# EAGLE design sensor_hubv3 (EAGLE 6.2)
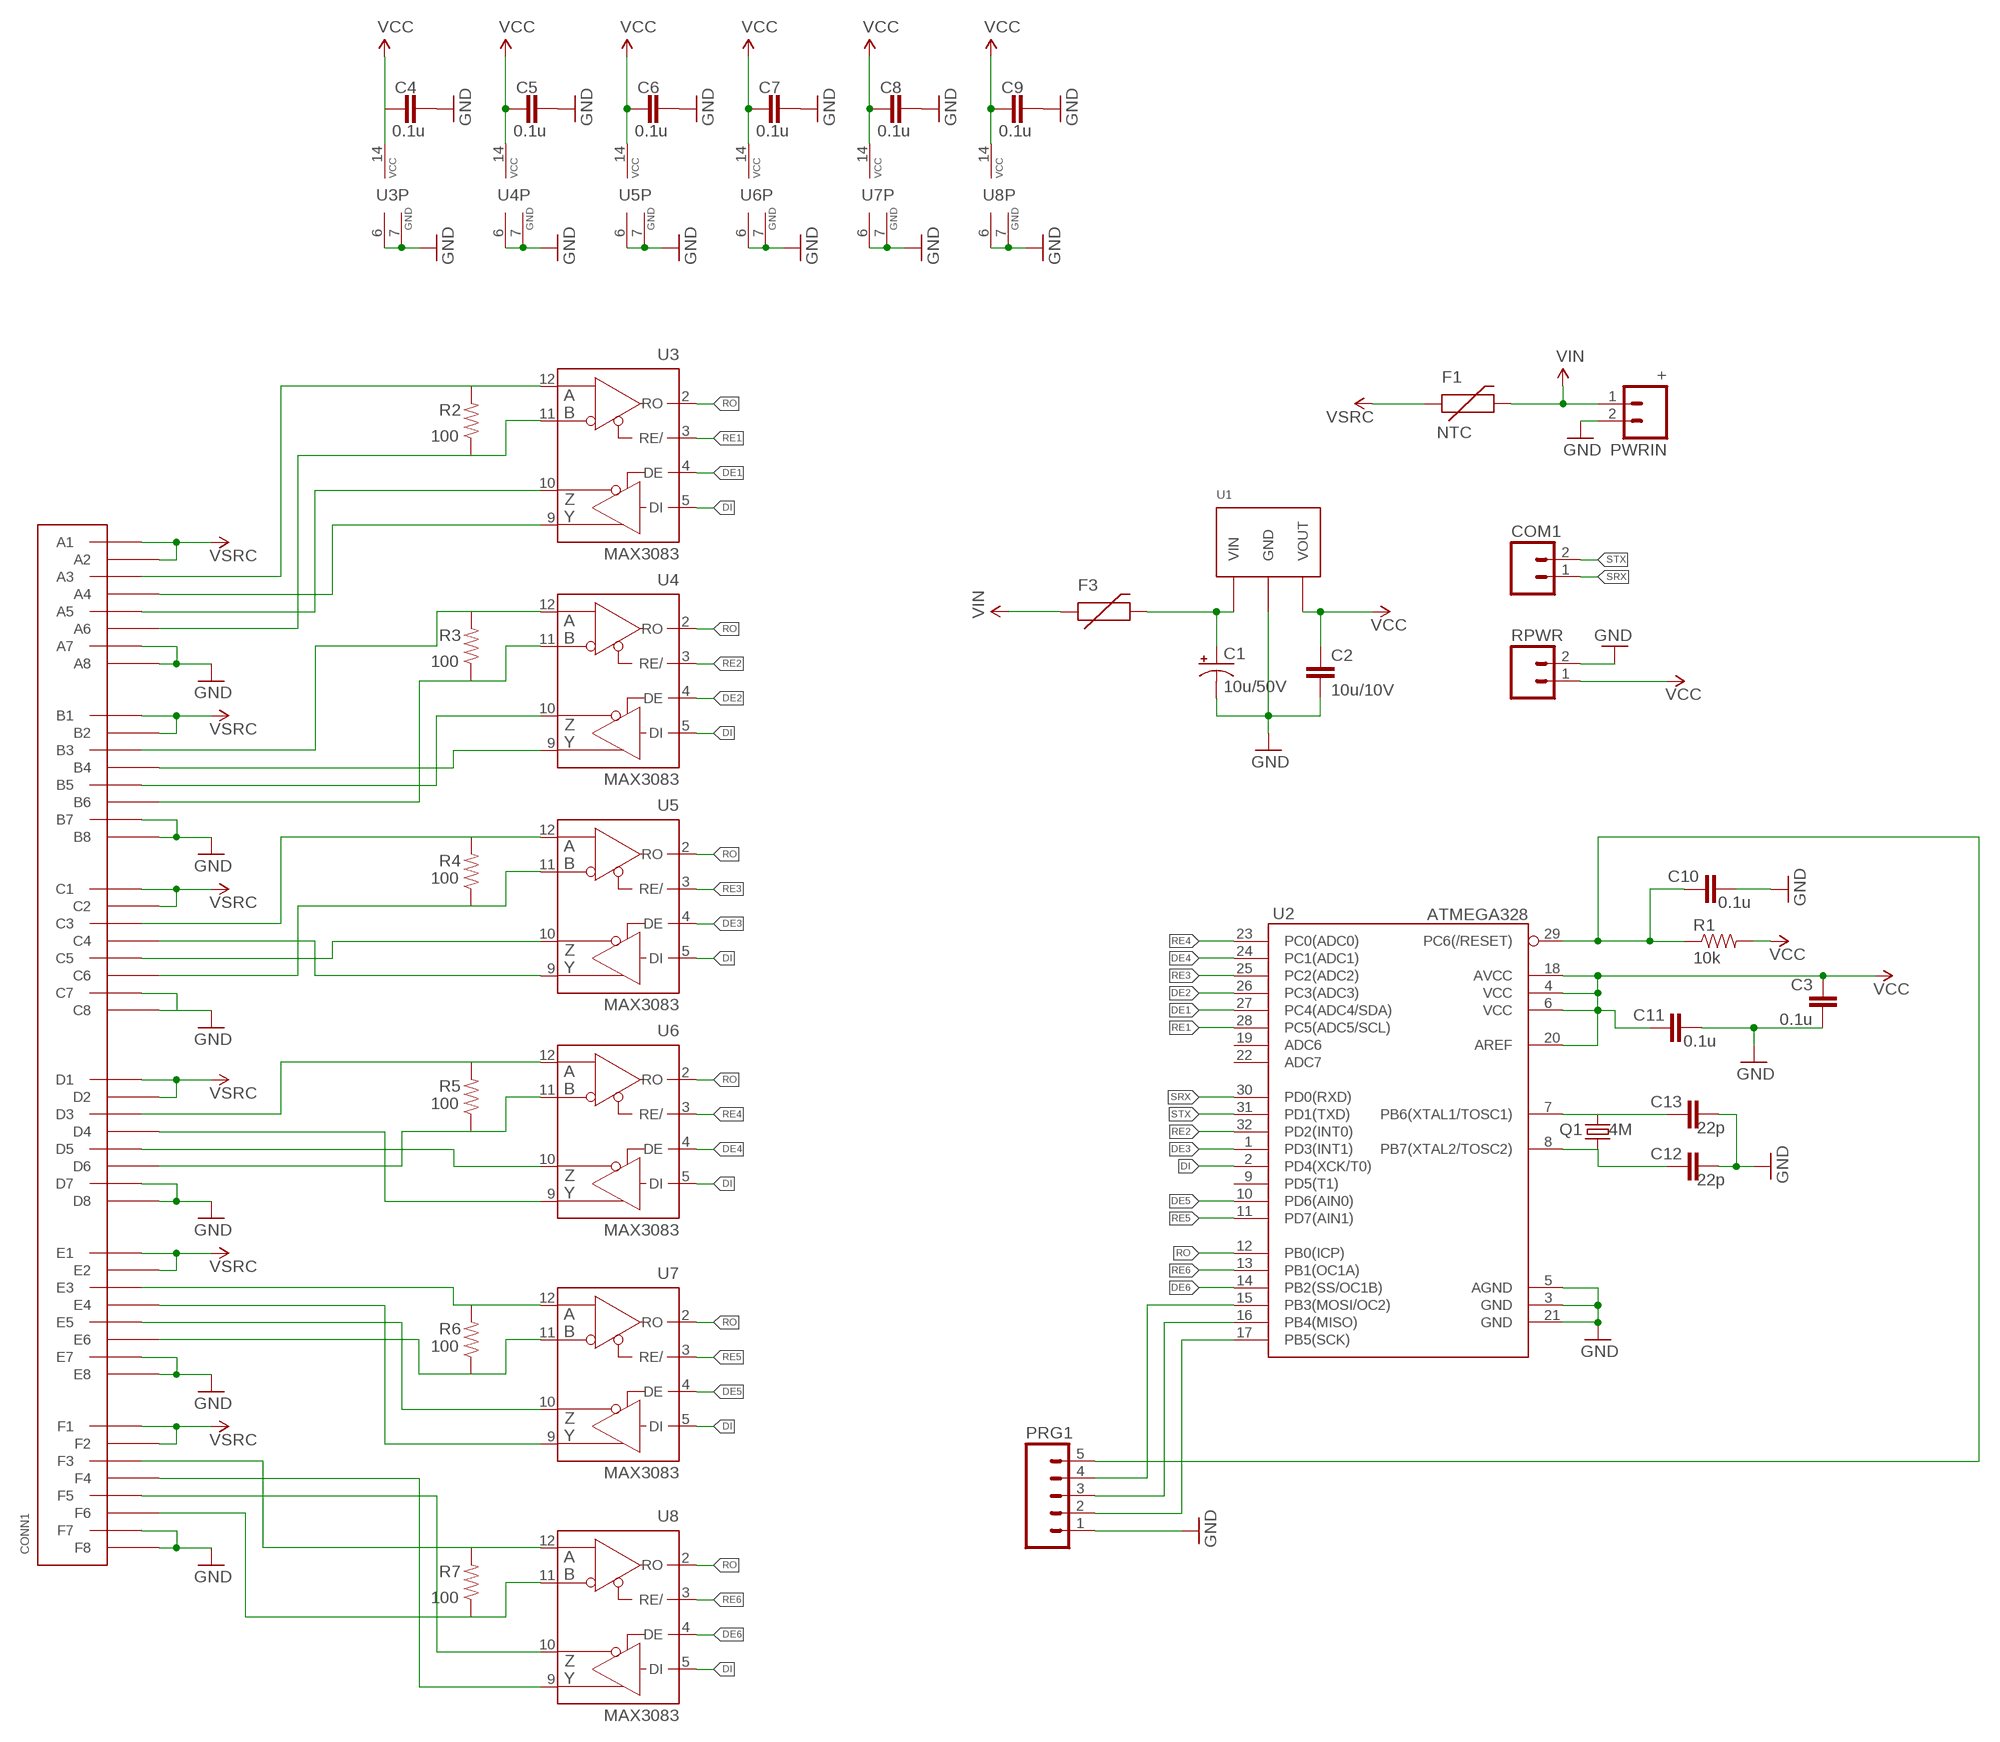
[diagram p0: schematic, sheet 1]

## Parts
C1  10u/50V  CAP_POLC  [PANASONIC_C]
C2  10u/10V  CAP0805  [0805]
C3  0.1u  CAP0805  [0805]
C4  0.1u  CAP0805  [0805]
C5  0.1u  CAP0805  [0805]
C6  0.1u  CAP0805  [0805]
C7  0.1u  CAP0805  [0805]
C8  0.1u  CAP0805  [0805]
C9  0.1u  CAP0805  [0805]
C10  0.1u  CAP0805  [0805]
C11  0.1u  CAP0805  [0805]
C12  22p  CAP0805  [0805]
C13  22p  CAP0805  [0805]
COM1  M02LOCK_LONGPADS  [1X02_LOCK_LONGPADS]
CONN1  8P8C-6PORT  [4UCON-04953]
F1  NTC  PTCPTH2  [R-7,5]
F3  PTC0603  [0603]
PRG1  M05LOCK  [1X05_LOCK]
PWRIN  +  M025MM  [SCREWTERMINAL-5MM-2]
Q1  4M  CRYSTALHC49UP  [HC49UP]
R1  10k  RESISTOR0805-RES  [0805]
R2  100  RESISTOR0805-RES  [0805]
R3  100  RESISTOR0805-RES  [0805]
R4  100  RESISTOR0805-RES  [0805]
R5  100  RESISTOR0805-RES  [0805]
R6  100  RESISTOR0805-RES  [0805]
R7  100  RESISTOR0805-RES  [0805]
RPWR  M02LOCK_LONGPADS  [1X02_LOCK_LONGPADS]
U1  OKI-78SR  [OKI-78SR]
U2  ATMEGA328  ATMEGA168  [TQFP32-08]
U3  MAX3083  MAX489CSD  [SO14]
U4  MAX3083  MAX489CSD  [SO14]
U5  MAX3083  MAX489CSD  [SO14]
U6  MAX3083  MAX489CSD  [SO14]
U7  MAX3083  MAX489CSD  [SO14]
U8  MAX3083  MAX489CSD  [SO14]

## Nets
DE1: U2.27(PC4(ADC4/SDA)) U3.4(DE)
DE2: U2.26(PC3(ADC3)) U4.4(DE)
DE3: U2.1(PD3(INT1)) U5.4(DE)
DE4: U2.24(PC1(ADC1)) U6.4(DE)
DE5: U2.10(PD6(AIN0)) U7.4(DE)
DE6: U2.14(PB2(SS/OC1B)) U8.4(DE)
DI: U2.2(PD4(XCK/T0)) U3.5(DI) U4.5(DI) U5.5(DI) U6.5(DI) U7.5(DI) U8.5(DI)
GND: C1.- C2.2 C3.1 C4.2 C5.2 C6.2 C7.2 C8.2 C9.2 C10.2 C11.2 C12.2 C13.2 CONN1.A7 CONN1.A8 CONN1.B7 CONN1.B8 CONN1.C7 CONN1.C8 CONN1.D7 CONN1.D8 CONN1.E7 CONN1.E8 CONN1.F7 CONN1.F8 PRG1.1 PWRIN.2 RPWR.2 U1.GND U2.3(GND) U2.5(AGND) U2.21(GND) U3.6(GND) U3.7(GND) U4.6(GND) U4.7(GND) U5.6(GND) U5.7(GND) U6.6(GND) U6.7(GND) U7.6(GND) U7.7(GND) U8.6(GND) U8.7(GND)
N$1: CONN1.C4 U5.9(Y)
N$2: C13.1 Q1.2 U2.7(PB6(XTAL1/TOSC1))
N$3: C1.+ F3.2 U1.VIN
N$4: C12.1 Q1.1 U2.8(PB7(XTAL2/TOSC2))
N$5: C10.1 PRG1.5 R1.1 U2.29(PC6(/RESET))
N$6: PRG1.4 U2.15(PB3(MOSI/OC2))
N$7: PRG1.3 U2.16(PB4(MISO))
N$8: PRG1.2 U2.17(PB5(SCK))
N$9: CONN1.A3 R2.2 U3.12(A)
N$10: CONN1.D6 R5.1 U6.11(B)
N$11: CONN1.C3 R4.2 U5.12(A)
N$12: CONN1.D3 R5.2 U6.12(A)
N$13: CONN1.E3 R6.2 U7.12(A)
N$14: CONN1.F3 R7.2 U8.12(A)
N$15: CONN1.A6 R2.1 U3.11(B)
N$16: CONN1.B6 R3.1 U4.11(B)
N$17: CONN1.C6 R4.1 U5.11(B)
N$18: CONN1.A5 U3.10(Z)
N$19: CONN1.E6 R6.1 U7.11(B)
N$20: CONN1.F6 R7.1 U8.11(B)
N$22: CONN1.B3 R3.2 U4.12(A)
N$23: CONN1.B5 U4.10(Z)
N$24: CONN1.C5 U5.10(Z)
N$25: CONN1.D5 U6.10(Z)
N$26: CONN1.E5 U7.10(Z)
N$27: CONN1.F5 U8.10(Z)
N$28: CONN1.A4 U3.9(Y)
N$29: CONN1.B4 U4.9(Y)
N$30: CONN1.D4 U6.9(Y)
N$31: CONN1.E4 U7.9(Y)
N$32: CONN1.F4 U8.9(Y)
RE1: U2.28(PC5(ADC5/SCL)) U3.3(RE/)
RE2: U2.32(PD2(INT0)) U4.3(RE/)
RE3: U2.25(PC2(ADC2)) U5.3(RE/)
RE4: U2.23(PC0(ADC0)) U6.3(RE/)
RE5: U2.11(PD7(AIN1)) U7.3(RE/)
RE6: U2.13(PB1(OC1A)) U8.3(RE/)
RO: U2.12(PB0(ICP)) U3.2(RO) U4.2(RO) U5.2(RO) U6.2(RO) U7.2(RO) U8.2(RO)
SRX: COM1.1 U2.30(PD0(RXD))
STX: COM1.2 U2.31(PD1(TXD))
VCC: C2.1 C3.2 C4.1 C5.1 C6.1 C7.1 C8.1 C9.1 C11.1 R1.2 RPWR.1 U1.VOUT U2.4(VCC) U2.6(VCC) U2.18(AVCC) U2.20(AREF) U3.14(VCC) U4.14(VCC) U5.14(VCC) U6.14(VCC) U7.14(VCC) U8.14(VCC)
VIN: F1.P$2 F3.1 PWRIN.1
VSRC: CONN1.A1 CONN1.A2 CONN1.B1 CONN1.B2 CONN1.C1 CONN1.C2 CONN1.D1 CONN1.D2 CONN1.E1 CONN1.E2 CONN1.F1 CONN1.F2 F1.P$1
Unconnected: U2.9(PD5(T1)) U2.19(ADC6) U2.22(ADC7) U3.1(NC) U3.8(NC) U3.13(NC) U4.1(NC) U4.8(NC) U4.13(NC) U5.1(NC) U5.8(NC) U5.13(NC) U6.1(NC) U6.8(NC) U6.13(NC) U7.1(NC) U7.8(NC) U7.13(NC) U8.1(NC) U8.8(NC) U8.13(NC)

## Library data of the parts
C1 = SparkFun-Capacitors:CAP_POL: Capacitor Polarized These are standard SMD and PTH capacitors. Normally 10uF, 47uF, and 100uF in electrolytic and tantalum varieties. Always verify the external diameter of the through hole cap, it varies with capacity, voltage, and manufacturer. The EIA devices should be standard.
C2-C13 = SparkFun-Passives:CAP: Capacitor Standard 0603 ceramic capacitor, and 0.1" leaded capacitor.
COM1 RPWR = SparkFun:M02: Header 2 Standard 2-pin 0.1" header. Use with straight break away headers (SKU : PRT-00116), right angle break away headers (PRT-00553), swiss pins (PRT-00743), machine pins (PRT-00117), and female headers (PRT-00115). Molex polarized connector foot print use with SKU : PRT-08233 with associated crimp pins and housings.
CONN1 = exoteric-analytics-custom:8P8C-6PORT
F1 F3 = exoteric-analytics-custom:PTC: Resettable Fuse PTC Resettable Fuse. Spark Fun Electronics SKU : COM-08357
PRG1 = SparkFun:M05: Header 5 Standard 5-pin 0.1" header. Use with straight break away headers (SKU : PRT-00116), right angle break away headers (PRT-00553), swiss pins (PRT-00743), machine pins (PRT-00117), and female headers (PRT-00115). Molex polarized connector foot print use with SKU : PRT-08230 with associated crimp pins and housings.
PWRIN = SparkFun-Connectors:M02: Header 2 Standard 2-pin 0.1" header. Use with straight break away headers (SKU : PRT-00116), right angle break away headers (PRT-00553), swiss pins (PRT-00743), machine pins (PRT-00117), and female headers (PRT-00115). Molex polarized connector foot print use with SKU : PRT-08233 with associated crimp pins and housings.
Q1 = crystal:CRYSTAL: CRYSTAL; OC_FARNELL: unknown; OC_NEWARK: unknown
R1-R7 = SparkFun-Passives:RESISTOR: Resistor Basic schematic elements and footprints for 0603, 1206, and PTH resistors.
U1 = exoteric-analytics-custom:OKI-78SR: DC/DC Converter
U2 = SparkFun-DigitalIC:ATMEGA168: Atmel 32-pin 8-bit micro, 16k flash.
U3-U8 = maxim:MAX489CSD: RS485 TRANSEIVER; MF: MAXIM; MPN: MAX489CSD; OC_FARNELL: 9724559; OC_NEWARK: 34C3923

## Board
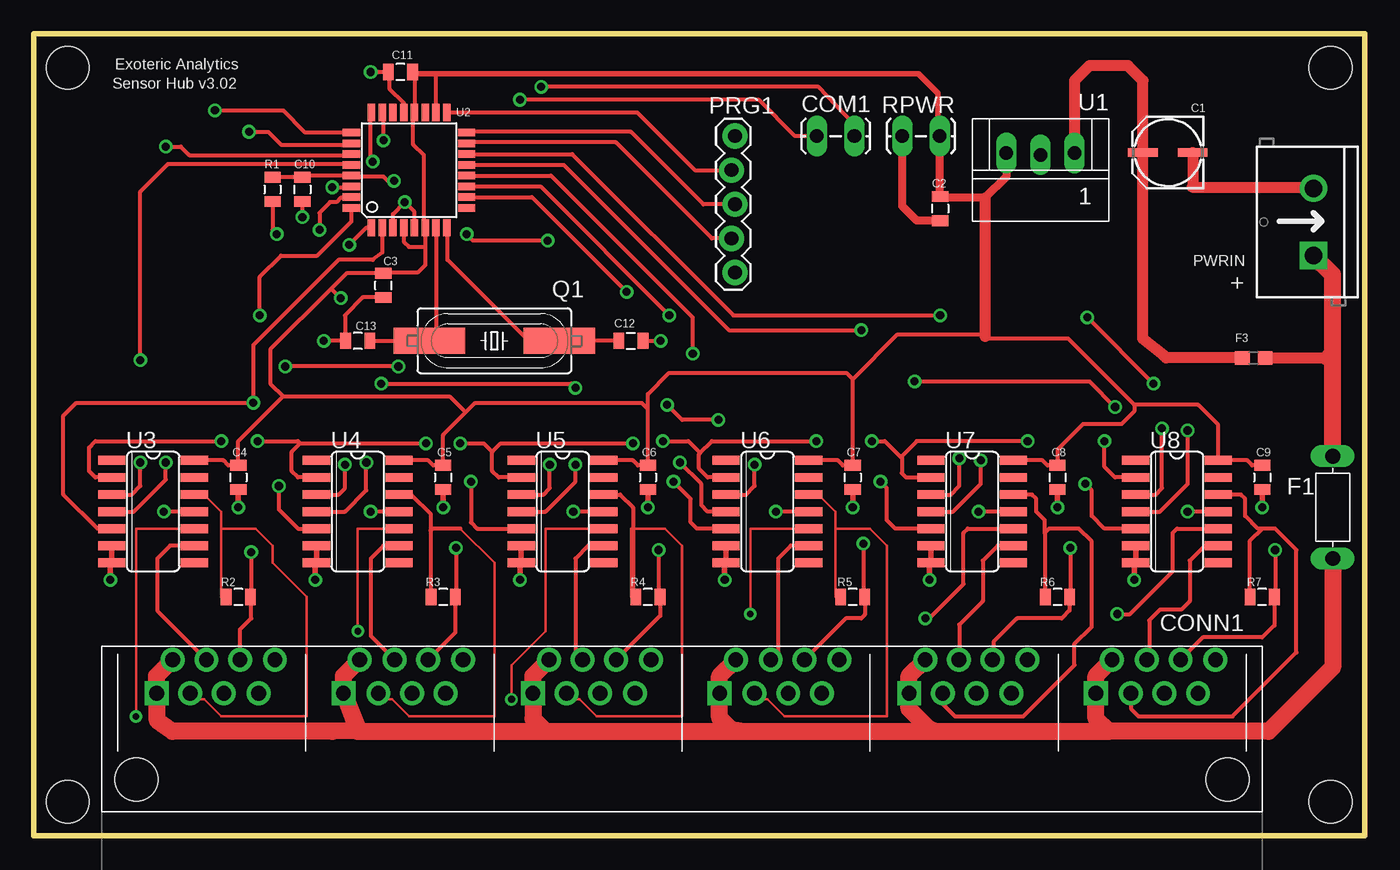
[diagram p1: board, top side]
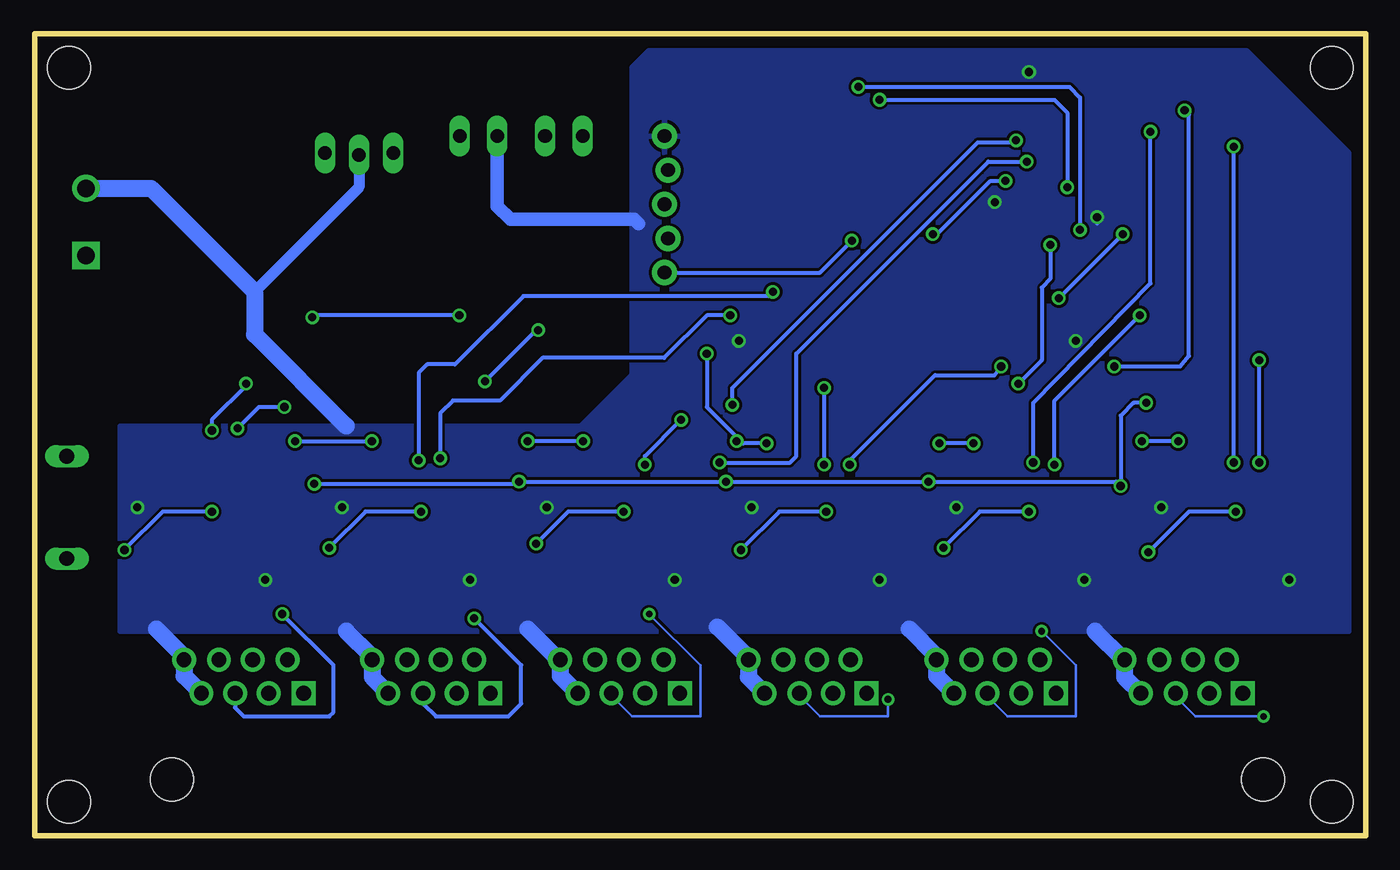
[diagram p2: board, bottom side, seen from below]

Size 99.06 x 59.69 mm. Coordinates in mm from the lower left corner, seen from the top.
Outline: 0,0 0,59.69 99.06,59.69 99.06,0 0,0
Copper layers (1*16): Top 0.035mm / dielectric 1.5mm / Bottom 0.035mm
Design rules: minimum track width 8mil, minimum drill 20mil, track to track 8mil, track to pad 8mil, pad to pad 8mil, via to via 8mil, smd to smd 8mil, copper to edge 20mil, drill to drill 8mil, minimum pad ring 10mil, minimum via ring 8mil, stop-mask expansion 4mil, vias tented up to drill 0mil, thermal gap 10mil
Holes 3.2 mm at 2.54,2.54 2.54,57.15 96.52,2.54 96.52,57.15

### Footprints (pad centres in the part's own frame; a part is rotated, then mirrored left to right if it is on the bottom)
PANASONIC_C = smd 2.2 x 0.65: + 1.9,-0.2; - -1.8,-0.2
0805 = smd 0.8 x 1.2: 1 -0.9,0; 2 0.9,0
1X02_LOCK_LONGPADS = drill 1.016 long: 1 -0.127,0; 2 2.667,0
4UCON-04953 = drill 1.1 pad 1.778 square: A1 -39.1,6.8; B1 -25.2,6.8; C1 -11.1,6.8; D1 2.8,6.8; E1 16.9,6.8; F1 30.8,6.8 | drill 1.1 pad 1.778: A2 -37.9,9.3; A3 -36.6,6.8; A4 -35.4,9.3; A5 -34.1,6.8; A6 -32.9,9.3; A7 -31.5,6.8; A8 -30.3,9.3; B2 -24,9.3; B3 -22.6,6.8; B4 -21.4,9.3; B5 -20.1,6.8; B6 -18.9,9.3; B7 -17.6,6.8; B8 -16.3,9.3; C2 -9.9,9.3; C3 -8.6,6.8; C4 -7.4,9.3; C5 -6.1,6.8; C6 -4.9,9.3; C7 -3.5,6.8; C8 -2.3,9.3; D2 4,9.3; D3 5.4,6.8; D4 6.6,9.3; D5 7.9,6.8; D6 9.1,9.3; D7 10.4,6.8; D8 11.7,9.3; E2 18.1,9.3; E3 19.4,6.8; E4 20.6,9.3; E5 21.9,6.8; E6 23.1,9.3; E7 24.5,6.8; E8 25.7,9.3; F2 32,9.3; F3 33.4,6.8; F4 34.6,9.3; F5 35.9,6.8; F6 37.1,9.3; F7 38.4,6.8; F8 39.7,9.3 | hole 3.2: -40.6,0.4; 40.6,0.4
R-7,5 = drill 1.1 long: P$1 -3.81,0; P$2 3.81,0
0603 = smd 1.1 x 1: 1 -0.85,0; 2 0.85,0
1X05_LOCK = drill 1.016 pad 1.88: 1 0,0.127; 2 2.54,-0.127; 3 5.08,0.127; 4 7.62,-0.127; 5 10.16,0.127
SCREWTERMINAL-5MM-2 = drill 1.3 pad 2.032 square: 1 0,0 | drill 1.3 pad 2.032: 2 5,0
HC49UP = smd 5.334 x 1.93: 1 -4.826,0; 2 4.826,0
OKI-78SR = drill 1 long: GND 0,-1.143; VIN -2.54,-1.27; VOUT 2.54,-1.27
TQFP32-08 = smd 1.27 x 0.559: 1 -4.293,2.8; 2 -4.293,2; 3 -4.293,1.2; 4 -4.293,0.4; 5 -4.293,-0.4; 6 -4.293,-1.2; 7 -4.293,-2; 8 -4.293,-2.8; 17 4.293,-2.8; 18 4.293,-2; 19 4.293,-1.2; 20 4.293,-0.4; 21 4.293,0.4; 22 4.293,1.2; 23 4.293,2; 24 4.293,2.8 | smd 0.559 x 1.27: 9 -2.8,-4.293; 10 -2,-4.293; 11 -1.2,-4.293; 12 -0.4,-4.293; 13 0.4,-4.293; 14 1.2,-4.293; 15 2,-4.293; 16 2.8,-4.293; 25 2.8,4.293; 26 2,4.293; 27 1.2,4.293; 28 0.4,4.293; 29 -0.4,4.293; 30 -1.2,4.293; 31 -2,4.293; 32 -2.8,4.293
SO14 = smd 0.66 x 2.032: 1 -3.81,-3.073; 2 -2.54,-3.073; 3 -1.27,-3.073; 4 0,-3.073; 5 1.27,-3.073; 6 2.54,-3.073; 7 3.81,-3.073; 8 3.81,3.073; 9 2.54,3.073; 10 1.27,3.073; 11 0,3.073; 12 -1.27,3.073; 13 -2.54,3.073; 14 -3.81,3.073

### Placement (x,y rotation side)
C1  84.45,50.64 180 top
C2  67.47,46.67 270 top
C3  26.04,40.96 90 top
C4  15.24,26.67 270 top
C5  30.48,26.67 270 top
C6  45.72,26.67 270 top
C7  60.96,26.67 270 top
C8  76.2,26.67 270 top
C9  91.44,26.67 270 top
C10  20,48.1 270 top
C11  27.3,56.83 180 top
C12  44.45,36.83 0 top
C13  24.13,36.83 180 top
COM1  58.42,52.07 0 top
CONN1  48.26,3.81 0 top
F1  96.68,24.45 90 top
F3  90.81,35.56 180 top
PRG1  52.07,52.07 270 top
PWRIN  95.25,43.18 90 top
Q1  34.29,36.83 180 top
R1  17.78,48.1 270 top
R2  15.24,17.78 180 top
R3  30.48,17.78 180 top
R4  45.72,17.78 180 top
R5  60.96,17.78 180 top
R6  76.2,17.78 180 top
R7  91.44,17.78 180 top
RPWR  67.31,52.07 180 top
U1  74.93,49.53 180 top
U2  27.94,49.53 90 top
U3  8.89,24.13 270 top
U4  24.13,24.13 270 top
U5  39.37,24.13 270 top
U6  54.61,24.13 270 top
U7  69.85,24.13 270 top
U8  85.09,24.13 270 top

### Tracks (layer width: path | path; a pad name or v marks a point on that pad's centre or on a via)
DE1  (via drill 0.6)
  Top 0.305: U3.4 7.46,24.13 9.84,26.51 v9.84,27.78 | v9.84,51.28 10.95,51.28 11.59,50.64 23.56,50.64 U2.27
  Bottom 0.305: v9.84,27.78 v9.84,51.28
DE2  (via drill 0.6)
  Top 0.305: U4.4 23.18,24.13 24.77,25.72 v24.77,27.78 | v16.03,52.39 17.46,52.39 18.41,51.44 23.55,51.44 U2.26
  Bottom 0.305: v24.77,27.78 24.77,32.23 16.03,41.12 v16.03,52.39
DE3  (via drill 0.6)
  Top 0.305: U5.4 38.1,24.13 40.32,26.35 v40.32,27.62 | U2.1 24.76,45.24 v23.5,43.97 | v25.88,33.66 40.01,33.66 v40.32,33.34
  Bottom 0.305: v23.5,43.97 23.5,41.43 24.13,40.8 24.13,35.4 v25.88,33.66 | v40.32,33.34 v40.32,27.62
DE4  (via drill 0.6)
  Top 0.305: U6.4 50.16,24.13 49.69,24.61 49.69,26.19 v48.1,27.78 | v25.24,50.16 25.24,50.32 25.08,50.48 25.08,53.77 U2.24
  Bottom 0.305: v48.1,27.78 42.86,27.78 42.39,28.26 42.39,35.88 28.1,50.16 v25.24,50.16
DE5  (via drill 0.6)
  Top 0.305: U7.4 68.42,24.13 70.48,26.19 v70.48,27.94 | U2.10 37.08,47.53 v44.13,40.48
  Bottom 0.305: v44.13,40.48 44.45,40.16 62.71,40.16 67.79,35.08 69.85,35.08 70.48,34.45 v70.48,27.94
DE6  (via drill 0.6)
  Top 0.305: U8.4 83.82,24.13 85.88,26.19 v85.88,30.16 | U2.14 40.08,50.73 52.07,38.73 v67.47,38.73 | v78.42,38.58 v83.34,33.66
  Bottom 0.305: v67.47,38.73 78.26,38.73 v78.42,38.58 | v83.34,33.66 83.34,33.5 85.88,30.96 v85.88,30.16
DI  (via drill 0.6)
  Top 0.305: U3.5 4.76,22.86 2.22,25.4 2.22,31.27 3.17,32.23 v16.35,32.23 16.35,36.51 22.7,42.86 25.24,42.86 25.94,43.4 U2.2 | v18.26,26.04 18.26,24.29 19.68,22.86 U4.5 | 36.04,22.86 U5.5 33.02,22.86 32.54,23.34 v32.54,26.35 | U6.5 49.37,22.86 48.9,23.34 48.9,25.08 v47.62,26.35 | U7.5 64.14,22.86 63.5,23.5 63.5,25.88 v63.02,26.35 | U8.5 79.69,22.86 78.74,23.81 78.74,25.72 v78.26,26.19
  Bottom 0.305: v16.35,32.23 17.3,32.23 18.26,31.27 v18.26,26.04 18.57,26.35 v32.54,26.35 v47.62,26.35 v63.02,26.35 63.18,26.19 v78.26,26.19
GND  (via drill 0.6)
  Top 0.305: C12.2 v46.67,36.83 | v21.59,36.83 C13.2 23.18,36.88 23.18,38.73 24.5,40.06 C3.1 | v25.08,56.83 C11.2 26.51,56.73 26.51,55.56 27.54,54.53 U2.21 | C10.2 v20,46.04 | U2.5 28.34,46.43 v27.62,47.15 26.74,46.27 U2.3
  Top 0.406: v5.71,19.05 5.71,20.32 U3.7 U3.6 | C4.2 v15.24,24.45 | C5.2 v30.48,24.45 | C6.2 v45.72,24.45 | C7.2 v60.96,24.45 | C8.2 v76.2,24.45 | C9.2 v91.44,24.45 | v20.95,19.05 20.95,20.32 U4.7 U4.6 | v36.2,19.05 36.2,20.32 U5.7 U5.6 | v51.44,19.05 51.44,20.32 U6.7 U6.6 | v66.67,19.05 66.67,20.32 U7.7 U7.6 | v81.92,19.05 81.92,20.32 U8.7 U8.6
  Top 0.61: C2.2 65.73,45.77 64.64,46.86 RPWR.2
  Top 0.813: C1.- 86.25,48.31 86.2,48.26 95.17,48.26 PWRIN.2
  Bottom 0.305: v46.67,36.83 46.99,36.83 | v21.59,36.83 21.27,36.83 | v25.08,56.83 24.77,56.83 | v20,46.04 20,45.56 | v27.62,47.15 27.3,47.15
  Bottom 0.406: v5.71,19.05 5.71,18.73 | v15.24,24.45 15.24,24.13 | v30.48,24.45 30.48,24.13 | v45.72,24.45 45.72,24.13 | v60.96,24.45 60.96,24.13 | v76.2,24.45 76.2,24.13 | v91.44,24.45 91.44,24.13 | v20.95,19.05 20.95,18.73 | v36.2,19.05 36.2,18.73 | v51.44,19.05 51.44,18.73 | v66.67,19.05 66.67,18.73 | v81.92,19.05 81.92,18.73
  Bottom 0.813: U1.GND 74.93,48.26 82.71,40.48
  Bottom 1.016: RPWR.2 64.64,46.86 63.66,45.88 54.45,45.88 54.13,45.56
  Bottom 1.27: PWRIN.2 90.41,48.18 82.71,40.48 82.71,37.31 75.88,30.48 | CONN1.F7 87.96,11.91 CONN1.F8 87.96,13.35 90.01,15.4 | CONN1.A7 17.96,11.81 CONN1.A8 18.03,13.11 20.16,15.24 | CONN1.B7 31.96,11.91 CONN1.B8 31.96,13.39 33.97,15.4 | CONN1.D7 59.96,11.91 CONN1.D8 60.1,13.11 62.39,15.4 | CONN1.E7 73.96,11.81 CONN1.E8 73.96,13.32 75.88,15.24 | CONN1.C7 45.96,11.81 CONN1.C8 45.96,13.26 48.26,15.56
  pour Bottom: 1.27,15.24 92.71,15.24 92.71,30.48 58.42,30.48 54.61,34.29 54.61,57.15 53.34,58.42 8.89,58.42 1.27,50.8
N$1
  Top 0.305: U5.9 41.27,21.59 40.32,20.64 40.32,13.65 CONN1.C4
N$2
  Top 0.305: C13.1 Q1.2 29.94,37.31 U2.7
N$3
  Top 0.813: U1.VIN 77.47,56.2 78.58,57.31 81.44,57.31 82.56,56.19 C1.+ 82.55,36.99 84.14,35.72 84.3,35.56 F3.2
N$4
  Top 0.305: C12.1 Q1.1 36.83,36.83 30.8,42.86 30.8,45.18 U2.8
N$5  (via drill 0.6)
  Top 0.305: R1.1 C10.1 20.13,49.13 U2.29 23.72,49.05 26.04,49.05 26.35,48.74 v26.83,48.74 | v38.26,44.29 32.7,44.29 v32.23,44.77
  Bottom 0.305: PRG1.5 40.64,41.91 v38.26,44.29 | v32.23,44.77 31.91,44.77 27.94,48.74 v26.83,48.74
N$6
  Top 0.305: PRG1.4 50.48,44.45 43.34,51.59 32.3,51.59 U2.15
N$7
  Top 0.305: PRG1.3 49.85,46.99 44.45,52.39 32.29,52.39 U2.16
N$8
  Top 0.305: U2.17 44.92,53.82 49.21,49.53 PRG1.2
N$9
  Top 0.203: 13.97,22.86 13.97,24.13 12.7,25.4 U3.12 | 13.97,22.86 13.97,17.78 R2.2 | 13.97,22.86 16.51,22.86 17.78,21.59 17.78,20.32 20.32,17.78 20.32,8.89 13.97,8.89 12.7,10.16 11.43,10.16 CONN1.A3
  Top 0.305: 14.13,17.57 R2.2
N$10  (via drill 0.6)
  Top 0.305: U6.11 v55.24,24.13 | v61.75,21.75 61.75,17.89 R5.1 61.86,16.46 61.59,16.19 60.44,16.19 CONN1.D6
  Bottom 0.305: 55.09,24.13 v55.24,24.13 59.37,24.13 v61.75,21.75
N$11
  Top 0.203: CONN1.C3 39.37,10.16 40.64,10.16 41.91,8.89 48.26,8.89 48.26,21.59 46.99,22.86 44.45,22.86 44.45,17.78 R4.2
  Top 0.305: U5.12 43.66,25.4 44.61,24.45 44.61,17.99 R4.2
N$12
  Top 0.203: 59.69,22.86 59.69,24.13 58.42,25.4 U6.12 | 59.69,22.86 59.69,17.78 R5.2 | 59.69,22.86 62.23,22.86 63.5,21.59 63.5,8.89 55.88,8.89 54.61,10.16 53.34,10.16 CONN1.D3
N$13
  Top 0.305: CONN1.E3 67.66,9.81 68.58,8.89 73.66,8.89 77.47,12.7 77.47,14.29 78.74,15.56 78.74,21.91 77.79,22.86 75.56,22.86 75.25,22.54 | 75.25,22.54 75.25,17.83 R6.2 | 75.25,22.54 75.25,23.5 74.61,24.13 74.61,25.08 74.3,25.4 U7.12
N$14
  Top 0.305: CONN1.F3 81.66,9.46 82.23,8.89 89.22,8.89 93.98,13.65 93.98,21.27 92.39,22.86 91.44,22.86 | 91.44,22.86 90.49,21.91 90.49,17.83 R7.2 | 91.44,22.86 91.12,22.86 90.17,23.81 90.17,25.08 89.85,25.4 U8.12
N$15  (via drill 0.6)
  Top 0.305: CONN1.A6 15.36,15.36 16.19,16.19 16.19,17.73 R2.1 16.19,17.83 v16.19,21.11 | U3.11 v9.68,24.13
  Bottom 0.305: 9.53,24.13 v9.68,24.13 13.18,24.13 v16.19,21.11
N$16  (via drill 0.6)
  Top 0.305: U4.11 v25.08,24.13 | v31.43,21.43 31.43,17.83 R3.1 31.38,15.13 CONN1.B6
  Bottom 0.305: 24.92,24.13 v25.08,24.13 28.73,24.13 v31.43,21.43
N$17  (via drill 0.6)
  Top 0.305: U5.11 v40.16,24.13 | v46.51,21.27 46.51,17.89 R4.1 46.62,16.37 CONN1.C6
  Bottom 0.305: 40.01,24.13 v40.16,24.13 43.66,24.13 v46.51,21.27
N$18  (via drill 0.51)
  Top 0.203: U3.10 7.62,22.86 v7.62,8.89
  Bottom 0.203: v7.62,8.89 12.7,8.89 13.97,10.16 CONN1.A5
N$19  (via drill 0.6)
  Top 0.305: CONN1.E6 71.44,13.19 71.44,14.45 73.18,16.19 76.52,16.19 77.1,16.77 R6.1 77.15,17.83 v77.15,21.43 | U7.11 v70.33,24.13
  Bottom 0.305: 70.17,24.13 v70.33,24.13 74.45,24.13 v77.15,21.43
N$20  (via drill 0.6)
  Top 0.305: CONN1.F6 87.01,14.76 91.44,14.76 92.34,15.66 R7.1 92.39,17.83 v92.39,21.27 | U8.11 v85.88,24.13
  Bottom 0.305: 85.72,24.13 v85.88,24.13 89.53,24.13 v92.39,21.27
N$22
  Top 0.203: 31.75,22.86 34.29,20.32 34.29,8.89 27.94,8.89 26.67,10.16 25.4,10.16 CONN1.B3
  Top 0.305: U4.12 28.1,25.4 29.53,23.97 29.53,22.71 | 29.53,22.71 29.53,17.83 R3.2 | 31.75,22.86 29.68,22.86 29.53,22.71
N$23  (via drill 0.51)
  Top 0.203: U4.10 24.13,22.86 v24.13,15.24
  Bottom 0.203: v24.13,15.24 21.59,12.7 21.59,8.89 26.67,8.89 27.94,10.16 CONN1.B5
N$24  (via drill 0.51)
  Top 0.203: U5.10 38.1,22.86 38.1,15.24 35.56,12.7 v35.56,10.16
  Bottom 0.203: v35.56,10.16 35.56,8.89 40.64,8.89 41.91,10.16 CONN1.C5
N$25  (via drill 0.51)
  Top 0.203: U6.10 53.34,22.86 v53.34,16.51
  Bottom 0.203: v53.34,16.51 49.53,12.7 49.53,8.89 54.61,8.89 55.88,10.16 CONN1.D5
N$26  (via drill 0.6)
  Top 0.305: v66.36,16.19 66.67,16.19 69.22,18.73 69.22,22.54 69.53,22.86 U7.10
  Bottom 0.305: CONN1.E5 70.16,9.84 69.22,8.89 63.82,8.89 62.87,9.84 62.87,12.7 v66.36,16.19
N$27  (via drill 0.6)
  Top 0.305: v80.64,16.51 81.6,16.51 84.77,19.68 84.77,22.54 85.09,22.86 U8.10
  Bottom 0.305: CONN1.F5 84.16,9.55 83.5,8.89 77.15,8.89 76.83,9.21 76.83,12.7 v80.64,16.51
N$28
  Top 0.305: U3.9 10.16,21.59 9.21,20.64 9.21,16.76 CONN1.A4
N$29
  Top 0.305: U4.9 26.04,21.59 25.08,20.64 25.08,14.89 CONN1.B4
N$30
  Top 0.305: U6.9 56.36,21.59 55.4,20.64 55.4,13.65 CONN1.D4
N$31
  Top 0.305: U7.9 71.75,21.59 70.64,20.48 70.64,17.46 68.9,15.72 68.9,13.15 CONN1.E4
N$32
  Top 0.305: U8.9 87.15,21.59 86.04,20.48 86.04,17.46 85.41,16.83 83.82,16.83 83.03,16.03 83.03,13.28 CONN1.F4
RE1  (via drill 0.6)
  Top 0.305: U3.3 7.3,25.4 7.94,26.04 v7.94,27.78 | v7.94,35.4 7.94,47.94 10,50.01 23.57,50.01 U2.28
  Bottom 0.305: v7.94,27.78 v7.94,35.4
RE2  (via drill 0.6)
  Top 0.305: U4.3 22.7,25.4 23.18,25.88 v23.18,27.62 | v16.83,38.73 16.83,41.59 18.41,43.18 21.11,43.18 23.65,45.72 U2.32
  Bottom 0.305: v23.18,27.62 23.18,32.38 v16.83,38.73
RE3  (via drill 0.6)
  Top 0.305: U5.3 37.94,25.4 38.42,25.88 v38.42,27.62 | U2.25 20.22,52.33 18.57,53.98 v13.49,53.98 | v27.15,34.92 v18.73,34.92
  Bottom 0.305: v38.42,27.62 38.42,27.94 32.07,34.29 27.62,34.29 v27.15,34.92 | v18.73,34.92 13.81,34.92 13.18,35.72 13.18,53.66 v13.49,53.98
RE4  (via drill 0.6)
  Top 0.305: U6.3 53.02,25.4 53.66,26.04 v53.66,27.62 | v50.96,30.96 48.26,30.96 v47.15,32.07 | v26.04,51.75 26.04,53.73 U2.23
  Bottom 0.305: v53.66,27.62 53.66,28.26 v50.96,30.96 | v47.15,32.07 47.15,33.34 28.89,51.59 26.19,51.59 v26.04,51.75
RE5  (via drill 0.6)
  Top 0.305: U7.3 68.26,25.4 68.9,26.04 v68.9,28.1 | U2.11 37.71,48.33 v47.31,38.73
  Bottom 0.305: v47.31,38.73 49.05,38.73 52.23,35.56 61.28,35.56 64.45,32.38 67.94,32.38 68.9,31.43 v68.9,28.1
RE6  (via drill 0.6)
  Top 0.305: U8.3 83.5,25.4 83.98,25.88 v83.98,30.32 | U2.13 39.45,49.93 51.75,37.62 v61.59,37.62 | v65.56,33.81 78.58,33.81 v80.49,31.91
  Bottom 0.305: v61.59,37.62 61.75,37.62 v65.56,33.81 | v80.49,31.91 82.39,31.91 v83.98,30.32
RO  (via drill 0.6)
  Top 0.305: U8.2 80.49,26.67 79.69,27.46 v79.69,29.37 | v73.98,29.37 65.72,29.37 64.61,28.26 64.61,28.1 | 64.61,28.1 64.61,26.99 64.93,26.67 U7.2 | U6.2 50.16,26.67 49.53,27.3 49.53,28.42 49.61,28.5 | 49.61,28.5 50.48,29.37 v58.26,29.37 | v62.39,29.37 63.34,29.37 64.61,28.1 | U5.2 34.61,26.67 34.13,27.15 34.13,28.57 | 34.13,28.57 34.77,29.21 v44.61,29.21 | v46.83,29.37 48.74,29.37 49.61,28.5 | U4.2 19.68,26.67 19.21,27.15 19.21,28.57 19.84,29.21 | 19.84,29.21 v29.21,29.21 | v31.75,29.21 33.5,29.21 34.13,28.57 | U3.2 4.6,26.67 4.13,27.15 4.13,28.89 4.6,29.37 v13.97,29.37 | v16.67,29.37 19.68,29.37 19.84,29.21 | U2.12 38.5,49.13 49.05,38.58 v49.05,35.88
  Bottom 0.305: v79.69,29.37 v73.98,29.37 | v58.26,29.37 v62.39,29.37 | v44.61,29.21 46.35,29.21 | 46.35,29.21 46.67,29.21 v46.83,29.37 | v29.21,29.21 v31.75,29.21 | v13.97,29.37 v16.67,29.37 | v49.05,35.88 49.05,31.91 46.35,29.21
SRX  (via drill 0.6)
  Top 0.305: COM1.1 56.67,52.07 53.98,54.77 v36.2,54.77 | v22.23,48.26 23.58,48.26 U2.30
  Bottom 0.305: v36.2,54.77 23.18,54.77 22.23,53.82 v22.23,48.26
STX  (via drill 0.6)
  Top 0.305: COM1.2 61.09,52.9 58.42,55.72 v37.78,55.72 | U2.31 23.58,47.47 22.86,47.47 22.54,47.15 22.07,47.15 21.27,46.35 v21.27,45.09
  Bottom 0.305: v37.78,55.72 22.07,55.72 21.27,54.93 v21.27,45.09
VCC  (via drill 0.6)
  Top 0.305: C9.1 90.7,27.57 90.33,27.94 U8.14 88.16,30.58 86.68,32.07 81.92,32.07 | U7.14 75.09,27.94 75.46,27.57 C8.1 76.2,28.73 78.11,30.64 80.96,30.64 81.92,31.59 81.92,32.07 | U6.14 59.85,27.94 60.22,27.57 C7.1 60.96,33.97 | U5.14 44.61,27.94 44.98,27.57 C6.1 45.72,31.75 | U4.14 29.37,27.94 29.74,27.57 C5.1 30.48,29.84 32.15,31.51 | U3.14 14.13,27.94 14.5,27.57 C4.1 15.24,29.37 18.57,32.7 | 81.92,32.07 76.99,36.99 71.12,36.99 70.8,37.31 | 60.96,33.97 64.29,37.31 70.64,37.31 70.8,37.47 | 45.72,31.75 45.72,32.86 47.31,34.45 60.48,34.45 60.96,33.97 | 32.15,31.51 32.86,32.23 45.24,32.23 45.72,31.75 | 18.57,32.7 30.96,32.7 32.15,31.51 | 29.14,43.81 U2.6 29.05,45.33 29.05,50.64 28.26,51.44 28.26,53.98 | 29.14,43.81 29.14,42.48 28.57,41.91 26.09,41.91 C3.2 23.28,41.86 22.15,40.72 | C11.1 28.34,56.7 U2.20 | U2.18 29.94,56.6 29.84,56.7 | U2.4 27.54,44.22 27.94,43.81 29.14,43.81 | 22.15,40.72 17.62,36.2 17.62,33.66 18.57,32.7 | R1.2 17.78,45.09 v18.1,44.77 | v22.86,40.01 22.15,40.72
  Top 0.406: 28.34,56.7 29.84,56.7 65.86,56.7 67.31,55.24 67.31,52.2 RPWR.1
  Top 0.61: U1.VOUT 72.39,49.05 70.8,47.47 67.58,47.47 C2.1 67.47,52.04 RPWR.1
  Top 0.813: 70.8,47.47 70.8,37.47 70.8,37.31 70.8,37.15
  Bottom 0.305: v18.1,44.77 v22.86,40.01
VIN
  Top 0.813: 96.2,35.4 96.28,35.48 | 96.28,35.48 96.36,35.56 | F3.1 96.2,35.56 96.28,35.48
  Top 1.27: F1.P$2 96.68,35.88 | 96.68,35.88 96.68,41.75 PWRIN.1 | 96.36,35.56 96.68,35.88
VSRC
  Top 1.27: CONN1.A2 9.16,11.91 CONN1.A1 9.21,10.56 9.21,8.57 10.32,7.78 22.23,7.78 24.17,7.82 CONN1.B1 | CONN1.B1 23.06,11.91 CONN1.B2 | CONN1.C2 37.16,11.91 CONN1.C1 37.16,8.72 38.1,7.78 | CONN1.D2 51.06,11.91 CONN1.D1 51.06,8.79 51.91,7.94 52.86,7.78 | CONN1.E2 65.16,11.91 CONN1.E1 65.16,9.45 66.52,8.1 67.15,7.78 | CONN1.F2 79.06,11.91 CONN1.F1 79.06,8.73 80.01,7.78 | F1.P$1 96.68,12.54 91.92,7.78 80.01,7.78 | 67.15,7.78 80.01,7.78 | 52.86,7.78 67.15,7.78 | CONN1.B1 23.85,8.53 24.13,7.78 38.1,7.78 | 38.1,7.78 52.86,7.78

### Text on the board
tPlace: Exoteric Analytics | Sensor Hub v3.02